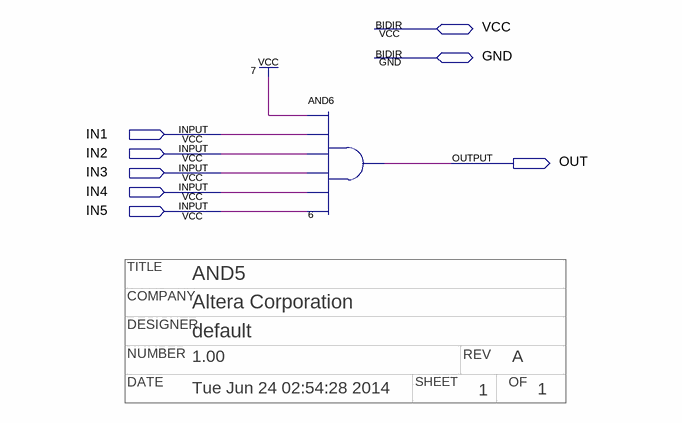
[diagram p0: schematic sheet]
// Quartus schematic npand5.bdf as structural Verilog: 1 symbols, 8 pins
// Title block: TITLE: AND5; COMPANY: Altera Corporation; DESIGNER: default; NUMBER: 1.00; REV: A; DATE: Tue Jun 24 02:54:28 2014; SHEET: 1; OF: 1
module npand5 (
  input  IN1,
  input  IN2,
  input  IN3,
  input  IN4,
  input  IN5,
  inout  VCC,
  inout  GND,
  output OUT
);

  and u_6 (OUT, 1'b1, IN1, IN2, IN3, IN4, IN5);
endmodule
